# Altium schematic sheet BB.001.01.20 Э3 (Силовой модуль).SchDoc
size 420 x 297 mm; Scale: {Масш.}; Title1str: Модуль силовой; PageSetup: Record=PageOptions|CenterHorizontal=False|CenterVertical=False|PrintScale=0.95|XCorrection=0.00|YCorrection=0.00|PrintKind=1|BorderSize=5000000|LeftOffset=0|BottomOffset=0|Orientation=1|PaperLength=1000|PaperWidth=1000|Scale=100|PaperSource=15|PrintQuality=600|MediaType=1|DitherType=10|PaperKind=A4|PrintScaleMode=1; ProcessInspection: {Т.контр.}; Mass: {Масса}; NormInspection: {Н.контр.}; EngineerName: {Инженер}; Letter1Column: {}; Letter2Column: {}; Letter3Column: {}; DocumentType: {Документ}; DocumentType1str: {Документ}; DocumentType2str: {Документ}; NachKonstrSekt: {Нач. КС}; NachPodrVydTz: {Рук.подр.выд.ТЗ}; NachSektNadezn: {Нач. СН}; ZamPoKonstr: {ZamPoKonstr}
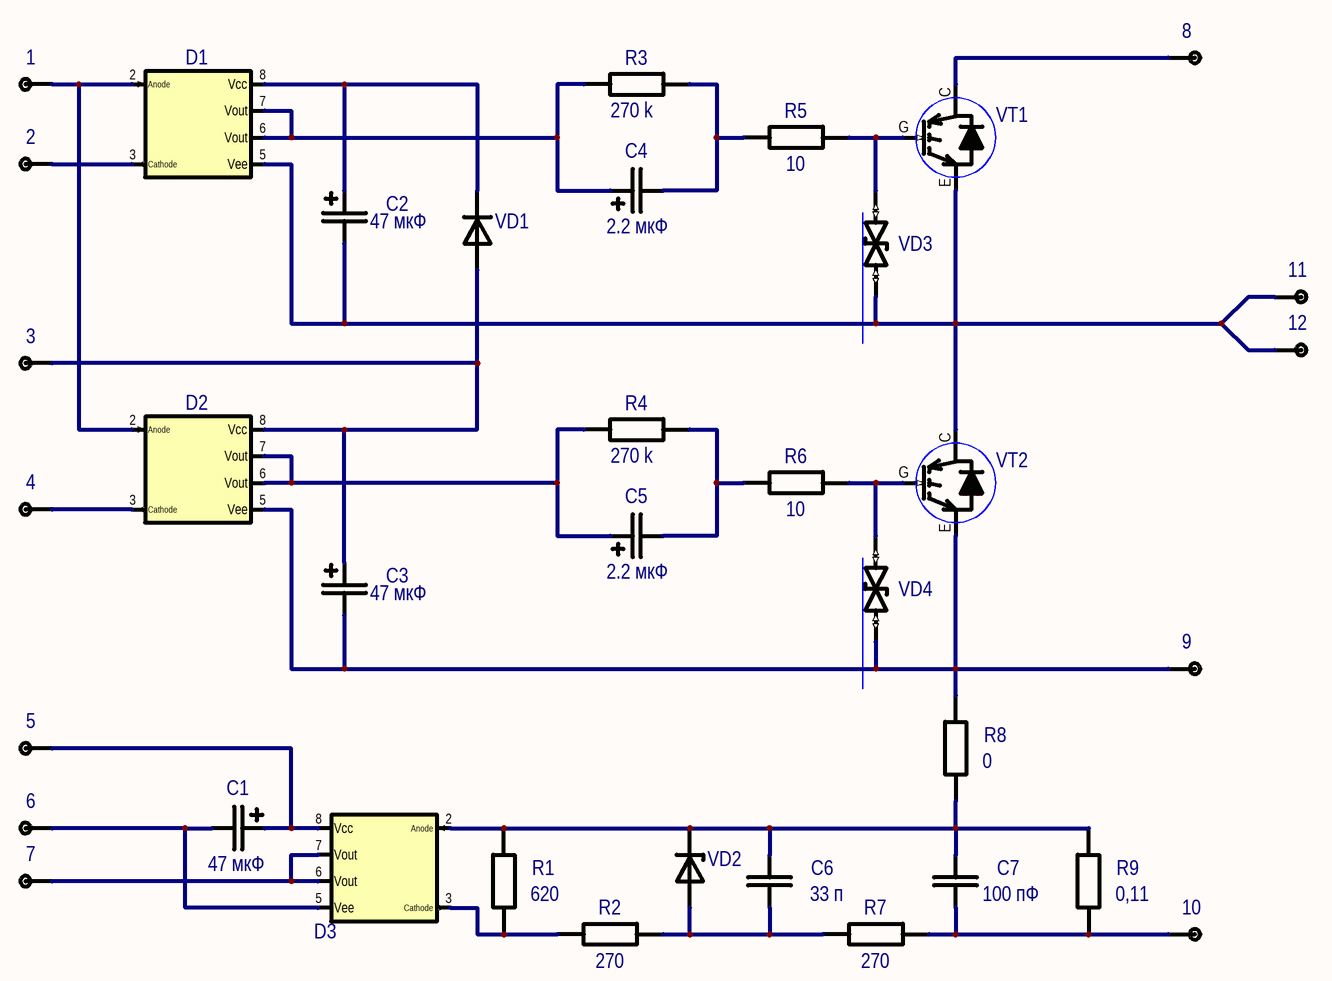
[diagram p0: BB.001.01.20 Э3 (Силовой модуль).SchDoc]

## Parts
1  TP  [TP1]  (value not drawn)  (no BOM)
2  TP  [TP1]  (value not drawn)  (no BOM)
3  TP  [TP1]  (value not drawn)  (no BOM)
4  TP  [TP1]  (value not drawn)  (no BOM)
5  TP  [TP1]  (value not drawn)  (no BOM)
6  TP  [TP1]  (value not drawn)  (no BOM)
7  TP  [TP1]  (value not drawn)  (no BOM)
8  TP  [TP1]  (value not drawn)  (no BOM)
9  TP  [TP1]  (value not drawn)  (no BOM)
10  TP  [TP1]  (value not drawn)  (no BOM)
11  TP  [TP1]  (value not drawn)  (no BOM)
12  TP  [TP1]  (value not drawn)  (no BOM)
C1  47 мкФ  [CAPMP7343X31N]
C2  47 мкФ  [CAPMP7343X31N]
C3  47 мкФ  [CAPMP7343X31N]
C4  2.2 мкФ  [CAPMP7343X31N]
C5  2.2 мкФ  [CAPMP7343X31N]
C6  33 п  [CAPC1632X115M]
C7  100 пФ  [CAPC1608M]
D1  МикросхемаHCPL-3120  [DIP-8]  (value not drawn)
D2  МикросхемаHCPL-3120  [DIP-8]  (value not drawn)
D3  МикросхемаHCPL-3120  [DIP-8]  (value not drawn)
R1  620  [RESC3216N]
R2  270  [RESC3216N]
R3  270 k  [RESC3216N]
R4  270 k  [RESC3216N]
R5  10  [RESC3216N]
R6  10  [RESC3216N]
R7  270  [RESC3216N]
R8  0  [RESC3216N]
R9  0,11  [RESC3216N]
VD1  FR20  [DO-15]  (value not drawn)
VD2  BZX5V1  [DO-35]  (value not drawn)
VD3  Stabistor_P6KE15CA  [D2A]  (value not drawn)
VD4  Stabistor_P6KE15CA  [D2A]  (value not drawn)
VT1  IGBT_IRG7PH42UD2PDF  [TO-247AC]  (value not drawn)
VT2  IGBT_IRG7PH42UD2PDF  [TO-247AC]  (value not drawn)

## Nets
Net1_1: 1.1 D1.2(Anode) D2.2(Anode)
Net2_1: 2.1 D1.3(Cathode)
Net3_1: 3.1 C3.2 D2.8(Vcc) VD1.1(Anode)
Net4_1: 4.1 D2.3(Cathode)
Net5_1: 5.1 C1.2 D3.8(Vcc)
Net6_1: 6.1 C1.1 D3.5(Vee)
Net7_1: 7.1 D3.6(Vout) D3.7(Vout)
Net8_1: 8.1 VT1.C
Net9_1: 9.1 C3.1 D2.5(Vee) R8.2 VD4.1(Anode) VT2.E
Net10_1: 10.1 C7.2 R7.2 R9.1
Net11_1: 11.1 12.1 C2.1 D1.5(Vee) VD3.1(Anode) VT1.E VT2.C
NetC2_2: C2.2 D1.8(Vcc) VD1.2(Cathode)
NetC4_1: C4.1 R3.2 R5.1
NetC4_2: C4.2 D1.6(Vout) D1.7(Vout) R3.1
NetC5_1: C5.1 R4.2 R6.1
NetC5_2: C5.2 D2.6(Vout) D2.7(Vout) R4.1
NetC6_1: C6.1 C7.1 D3.2(Anode) R1.2 R8.1 R9.2 VD2.2(Cathode)
NetC6_2: C6.2 R2.2 R7.1 VD2.1(Anode)
NetD3_3: D3.3(Cathode) R1.1 R2.1
NetR5_2: R5.2 VD3.2(Cathode) VT1.G
NetR6_2: R6.2 VD4.2(Cathode) VT2.G

## Notes on the sheet
- Перв. примен.
- Зам.гл.к.по констр.
- Справ. №
- Нач. подр. выд.ТЗ
- Подп. и дата
- Инв. № дубл.
- Взам. инв. №
- СН
- Изм.
- Лист
- № докум.
- Подп.
- Дата
- Лит.
- Масса
- Масштаб
- Т.контр.
- Пров.
- Разраб.
- Листов
- Нач. КС
- Инв. № подл.
- Н.контр.
- Утв.
- Копировал
- Формат А3

## Library data of the parts
1-12 = TP: Test point
C1-C3 C5 = Capacitor_Polar_TAJD: Танталовый конденсатор; Name: TAJD; Power/Voltage: 50 B; Tolerance: {Tolerance}; BCPId: *; Manufacturer: *; TKE/TKC: *; ManufacturerPartNumber: *; Type: Конденсатор
  C1-C3: Value: 47 мкФ
  C5: Value: 2.2 мкФ
C4 = Capacitor_Polar_TAJD: Танталовый конденсатор; Name: TAJD; Power/Voltage: 50; Tolerance: {Tolerance}; BCPId: *; Manufacturer: *; TKE/TKC: *; ManufacturerPartNumber: *; Type: Конденсатор; Value: 2.2 мкФ
C6 C7 = Capacitor_Chip: Чип-конденсатор; Name: 1206; Power/Voltage: 50 B; TKE/TKC: {TKE/TKC}; Tolerance: {Tolerance}; BCPId: *; Manufacturer: *; ManufacturerPartNumber: *; Type: Конденсатор
  C6: Value: 33 п
  C7: Value: 100 пФ
D1 = Device_HCPL-3120: 2.5 Amp Output Current IGBT Gate Drive Optocoupler; Manufacturer: Avago, Avago Technologies; Rule: Undefined; ManufacturerPartNumber: HCPL-3120; BCPId: *; Category: Микросхема; ComponentLink1URL: k:\Projects\BB.001.00.00 (Преобразователь частотный)\Datashets\Функциональная группа ''A1''\hcpl-3120-500e.pdf; ComponentLink1Description: DataSheet; ComponentLink2Description: Package; ComponentLink2URL: k:\Projects\BB.001.00.00 (Преобразователь частотный)\Datashets\Функциональная группа ''A1''\hcpl-3120-500e.pdf#page=3
D2 D3 = Device_HCPL-3120: 2.5 Amp Output Current IGBT Gate Drive Optocoupler; Manufacturer: Avago, Avago Technologies; Rule: PcbType=ProtelPcb; ManufacturerPartNumber: HCPL-3120; BCPId: *; Category: Микросхема; ComponentLink1URL: k:\Projects\BB.001.00.00 (Преобразователь частотный)\Datashets\Функциональная группа ''A1''\hcpl-3120-500e.pdf; ComponentLink1Description: DataSheet; ComponentLink2Description: Package; ComponentLink2URL: k:\Projects\BB.001.00.00 (Преобразователь частотный)\Datashets\Функциональная группа ''A1''\hcpl-3120-500e.pdf#page=3
R1-R9 = Resistor_Chip: Чип-резистор; Tolerance: {Tolerance}; BCPId: *; Manufacturer: *; Name: *; Type: Резистор
  R1: Value: 620
  R2 R7: Value: 270
  R3 R4: Value: 270 k
  R5 R6: Value: 10
  R8: Value: 0
  R9: Value: 0,11
VD1 = Diode_FR20..Serial: Диод; Manufacturer: WTE power Semiconductor; BCPId: *; Rem: *; Package: *; ManufacturerPartNumber: FR20; Type: Диод; TU/GOST: *; HelpURL: *; Price: *
VD2 = Diode_BZX5V1: Диод; Manufacturer: WTE power Semiconductor; BCPId: *; Rem: *; Package: *; ManufacturerPartNumber: BZX5V1; Type: Диод; TU/GOST: *; HelpURL: *; Price: *
VD3 VD4 = Stabistor_P6KE15CA: Стабилитрон; BCPId: *; Name: *; ManufacturerPartNumber: P6KE15CA; Type: Стабилитрон; Manufacturer: *
VT1 VT2 = IGBT_IRG7PH42UD2PDF: insulated gate bipolar transistor with  ultrafast soft recovery diode; ManufacturerPartNumber: IRG7PH42UD2PDF; BCPId: *; Manufacturer: *; Package: TO-247AC